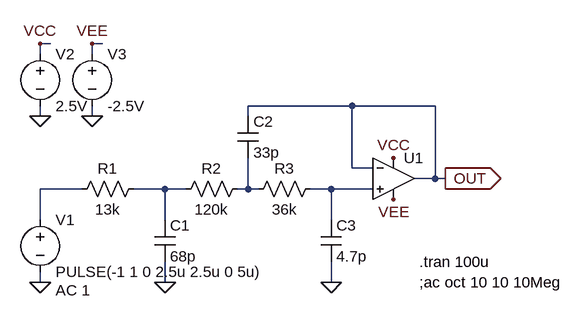
[diagram p0: schematic 3rd VCVS.asc]
3rd VCVS.asc, the LTspice schematic file:
Version 4
SHEET 1 880 680
WIRE -224 -112 -240 -112
WIRE -144 -112 -160 -112
WIRE -240 -96 -240 -112
WIRE -160 -96 -160 -112
WIRE 240 -16 80 -16
WIRE 368 -16 240 -16
WIRE -240 0 -240 -16
WIRE -160 0 -160 -16
WIRE 80 0 80 -16
WIRE 240 80 240 -16
WIRE 272 80 240 80
WIRE 368 96 368 -16
WIRE 368 96 336 96
WIRE 384 96 368 96
WIRE -176 112 -240 112
WIRE -48 112 -96 112
WIRE -16 112 -48 112
WIRE 80 112 80 64
WIRE 80 112 64 112
WIRE 96 112 80 112
WIRE 208 112 176 112
WIRE 272 112 208 112
WIRE -240 160 -240 112
WIRE -48 160 -48 112
WIRE 208 160 208 112
WIRE -240 256 -240 240
WIRE -48 256 -48 224
WIRE 208 256 208 224
FLAG -240 256 0
FLAG 208 256 0
FLAG -240 0 0
FLAG -160 0 0
FLAG -240 -112 VCC
FLAG -160 -112 VEE
FLAG 304 64 VCC
FLAG 304 128 VEE
FLAG 384 96 OUT
IOPIN 384 96 Out
FLAG -48 256 0
SYMBOL Opamps\\UniversalOpamp2 304 96 R0
SYMATTR InstName U1
SYMBOL res 80 96 R90
WINDOW 0 0 56 VBottom 2
WINDOW 3 32 56 VTop 2
SYMATTR InstName R2
SYMATTR Value 120k
SYMBOL res 192 96 R90
WINDOW 0 0 56 VBottom 2
WINDOW 3 32 56 VTop 2
SYMATTR InstName R3
SYMATTR Value 36k
SYMBOL cap 64 0 R0
SYMATTR InstName C2
SYMATTR Value 33p
SYMBOL cap 192 160 R0
SYMATTR InstName C3
SYMATTR Value 4.7p
SYMBOL voltage -240 144 R0
WINDOW 123 24 124 Left 2
WINDOW 39 0 0 Left 2
SYMATTR Value2 AC 1
SYMATTR InstName V1
SYMATTR Value PULSE(-1 1 0 2.5u 2.5u 0 5u)
SYMBOL voltage -240 -112 R0
WINDOW 123 0 0 Left 2
WINDOW 39 0 0 Left 2
SYMATTR InstName V2
SYMATTR Value 2.5V
SYMBOL voltage -160 -112 R0
WINDOW 123 0 0 Left 2
WINDOW 39 0 0 Left 2
SYMATTR InstName V3
SYMATTR Value -2.5V
SYMBOL cap -64 160 R0
SYMATTR InstName C1
SYMATTR Value 68p
SYMBOL res -80 96 R90
WINDOW 0 0 56 VBottom 2
WINDOW 3 32 56 VTop 2
SYMATTR InstName R1
SYMATTR Value 13k
TEXT 344 224 Left 2 !.tran 100u
TEXT 344 256 Left 2 !;ac oct 10 10 10Meg

The netlist it stands for:
* 3rd VCVS.asc
XU1 N004 OUT VCC VEE OUT level.2 Avol=1Meg GBW=10Meg Slew=10Meg ilimit=25m rail=0 Vos=0 phimargin=45 en=0 enk=0 in=0 ink=0 Rin=500Meg  ; pins IN+ IN- V+ V- OUT
R2 N003 N002 120k
R3 N004 N003 36k
C2 OUT N003 33p
C3 N004 0 4.7p
V1 N001 0 PULSE(-1 1 0 2.5u 2.5u 0 5u) AC 1
V2 VCC 0 2.5V
V3 VEE 0 -2.5V
C1 N002 0 68p
R1 N002 N001 13k
.tran 100u
;ac oct 10 10 10Meg
.lib UniversalOpamps2.sub
.backanno
.end